# EAGLE design LEGO-Pi (EAGLE 6.5.0)
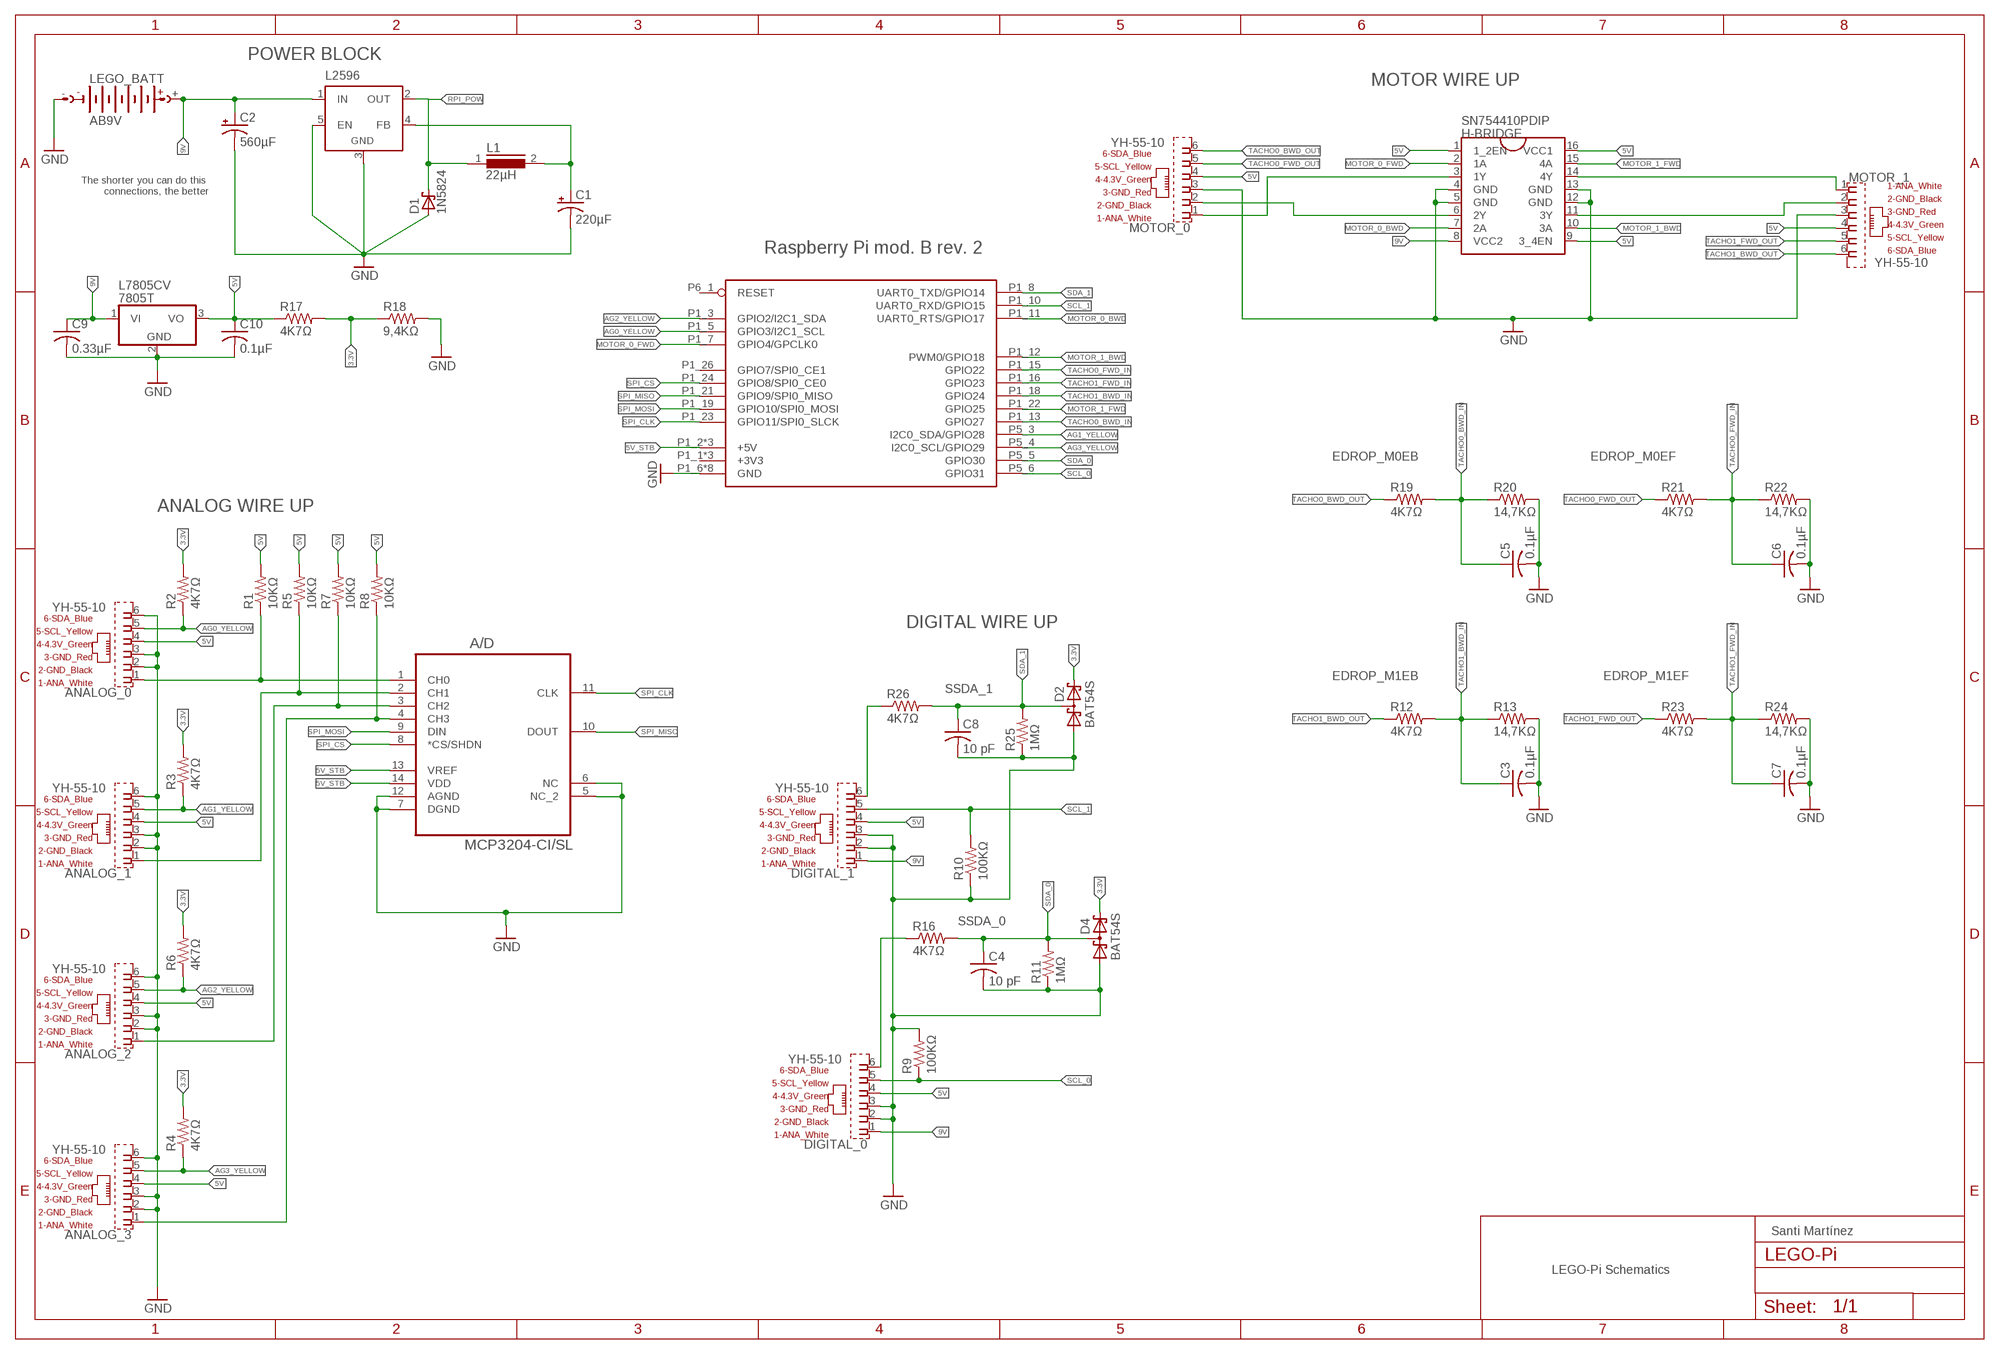
[diagram p0: schematic, sheet 1]

## Parts
A/D  MCP3204-CI/SL  [SOIC127P600X175-14N]
ANALOG_0  YH-55-10  [YH-55-10]
ANALOG_1  YH-55-10  [YH-55-10]
ANALOG_2  YH-55-10  [YH-55-10]
ANALOG_3  YH-55-10  [YH-55-10]
C1  220µF  CPOL-US085CS-1AR  [085CS_1AR]
C2  560µF  CPOL-US085CS-1AR  [085CS_1AR]
C3  0.1µF  C-US025-024X044  [C025-024X044]
C4  10 pF  C-US025-024X044  [C025-024X044]
C5  0.1µF  C-US025-024X044  [C025-024X044]
C6  0.1µF  C-US025-024X044  [C025-024X044]
C7  0.1µF  C-US025-024X044  [C025-024X044]
C8  10 pF  C-US025-024X044  [C025-024X044]
C9  0.33µF  C-US025-024X044  [C025-024X044]
C10  0.1µF  C-US025-024X044  [C025-024X044]
D1  1N5824  1N5908  [C4111-15]
D2  BAT54S  [SOT23]
D4  BAT54S  [SOT23]
DIGITAL_0  YH-55-10  [YH-55-10]
DIGITAL_1  YH-55-10  [YH-55-10]
H-BRIDGE  SN754410PDIP  [DIL16]
L1  22µH  SFT1040  [SFT1040]
L2596  LM2596TH  [TO220-52]
L7805CV  7805T  [TO220H]
LEGO_BATT  AB9V  [AB9V]
MOTOR_0  YH-55-10  [YH-55-10]
MOTOR_1  YH-55-10  [YH-55-10]
R1  10KΩ  R-US_0204/2V  [0204V]
R2  4K7Ω  R-US_0204/2V  [0204V]
R3  4K7Ω  R-US_0204/2V  [0204V]
R4  4K7Ω  R-US_0204/2V  [0204V]
R5  10KΩ  R-US_0204/2V  [0204V]
R6  4K7Ω  R-US_0204/2V  [0204V]
R7  10KΩ  R-US_0204/2V  [0204V]
R8  10KΩ  R-US_0204/2V  [0204V]
R9  100KΩ  R-US_0204/2V  [0204V]
R10  100KΩ  R-US_0204/2V  [0204V]
R11  1MΩ  R-US_0207/5V  [0207/5V]
R12  4K7Ω  R-US_0207/5V  [0207/5V]
R13  14,7KΩ  R-US_0207/5V  [0207/5V]
R16  4K7Ω  R-US_0207/5V  [0207/5V]
R17  4K7Ω  R-US_0207/5V  [0207/5V]
R18  9,4KΩ  R-US_0207/5V  [0207/5V]
R19  4K7Ω  R-US_0207/5V  [0207/5V]
R20  14,7KΩ  R-US_0207/5V  [0207/5V]
R21  4K7Ω  R-US_0207/5V  [0207/5V]
R22  14,7KΩ  R-US_0207/5V  [0207/5V]
R23  4K7Ω  R-US_0207/5V  [0207/5V]
R24  14,7KΩ  R-US_0207/5V  [0207/5V]
R25  1MΩ  R-US_0207/5V  [0207/5V]
R26  4K7Ω  R-US_0207/5V  [0207/5V]
U$1  RPI-B-V2  [RPI-A-SHIELD]

## Nets
3.3V [Logic_Power]: D2.2(C2) D4.2(C2) R2.2 R3.2 R4.2 R6.2 R17.2 R18.1
5V [Logic_Power]: ANALOG_0.4(4_4.3V_GREEN) ANALOG_1.4(4_4.3V_GREEN) ANALOG_2.4(4_4.3V_GREEN) ANALOG_3.4(4_4.3V_GREEN) C10.1 DIGITAL_0.4(4_4.3V_GREEN) DIGITAL_1.4(4_4.3V_GREEN) H-BRIDGE.1(1_2EN) H-BRIDGE.9(3_4EN) H-BRIDGE.16(VCC1) L7805CV.3(VO) MOTOR_0.4(4_4.3V_GREEN) MOTOR_1.4(4_4.3V_GREEN) R1.2 R5.2 R7.2 R8.2 R17.1
5V_STB [Logic_Power]: A/D.13(VREF) A/D.14(VDD) U$1.P1_2(+5V) U$1.P1_4(+5V) U$1.P5_1(+5V)
9V [Power]: C2.+ C9.1 DIGITAL_0.1(1_ANA_WHITE) DIGITAL_1.1(1_ANA_WHITE) H-BRIDGE.8(VCC2) L2596.1(IN) L7805CV.1(VI) LEGO_BATT.+
AG0_YELLOW: ANALOG_0.5(5_SCL_YELLOW) R2.1 U$1.P1_5(GPIO3/I2C1_SCL)
AG1_YELLOW: ANALOG_1.5(5_SCL_YELLOW) R3.1 U$1.P5_3(I2C0_SDA/GPIO28)
AG2_YELLOW: ANALOG_2.5(5_SCL_YELLOW) R6.1 U$1.P1_3(GPIO2/I2C1_SDA)
AG3_YELLOW: ANALOG_3.5(5_SCL_YELLOW) R4.1 U$1.P5_4(I2C0_SCL/GPIO29)
GND [Power]: A/D.5(NC_2) A/D.6(NC) A/D.7(DGND) A/D.12(AGND) ANALOG_0.2(2_GND_BLACK) ANALOG_0.3(3_GND_RED) ANALOG_0.6(6_SDA_BLUE) ANALOG_1.2(2_GND_BLACK) ANALOG_1.3(3_GND_RED) ANALOG_1.6(6_SDA_BLUE) ANALOG_2.2(2_GND_BLACK) ANALOG_2.3(3_GND_RED) ANALOG_2.6(6_SDA_BLUE) ANALOG_3.2(2_GND_BLACK) ANALOG_3.3(3_GND_RED) ANALOG_3.6(6_SDA_BLUE) C1.- C2.- C3.2 C4.2 C5.2 C6.2 C7.2 C8.2 C9.2 C10.2 D1.A D2.1(A1) D4.1(A1) DIGITAL_0.2(2_GND_BLACK) DIGITAL_0.3(3_GND_RED) DIGITAL_1.2(2_GND_BLACK) DIGITAL_1.3(3_GND_RED) H-BRIDGE.4(GND) H-BRIDGE.5(GND) H-BRIDGE.12(GND) H-BRIDGE.13(GND) L2596.3(GND) L2596.5(EN) L7805CV.2(GND) LEGO_BATT.- MOTOR_0.3(3_GND_RED) MOTOR_1.3(3_GND_RED) R9.2 R10.1 R11.1 R13.2 R18.2 R20.2 R22.2 R24.2 R25.1 U$1.P1_6(GND) U$1.P1_9(GND) U$1.P1_14(GND) U$1.P1_20(GND) U$1.P1_25(GND) U$1.P5_7(GND) U$1.P5_8(GND) U$1.P6_2(GND)
MOTOR_0_BWD: H-BRIDGE.7(2A) U$1.P1_11(UART0_RTS/GPIO17)
MOTOR_0_FWD: H-BRIDGE.2(1A) U$1.P1_7(GPIO4/GPCLK0)
MOTOR_1_BWD: H-BRIDGE.10(3A) U$1.P1_12(PWM0/GPIO18)
MOTOR_1_FWD: H-BRIDGE.15(4A) U$1.P1_22(GPIO25)
N$1: H-BRIDGE.14(4Y) MOTOR_1.1(1_ANA_WHITE)
N$2: H-BRIDGE.11(3Y) MOTOR_1.2(2_GND_BLACK)
N$3: A/D.2(CH1) ANALOG_1.1(1_ANA_WHITE) R5.1
N$4: A/D.1(CH0) ANALOG_0.1(1_ANA_WHITE) R1.1
N$5: C1.+ L1.2 L2596.4(FB)
N$6: A/D.3(CH2) ANALOG_2.1(1_ANA_WHITE) R7.1
N$7: A/D.4(CH3) ANALOG_3.1(1_ANA_WHITE) R8.1
N$9: H-BRIDGE.6(2Y) MOTOR_0.2(2_GND_BLACK)
N$10: H-BRIDGE.3(1Y) MOTOR_0.1(1_ANA_WHITE)
N$11: DIGITAL_0.6(6_SDA_BLUE) R16.1
N$13: DIGITAL_1.6(6_SDA_BLUE) R26.1
RPI_POW [Power]: D1.C L1.1 L2596.2(OUT)
SCL_0: DIGITAL_0.5(5_SCL_YELLOW) R9.1 U$1.P5_6(GPIO31)
SCL_1: DIGITAL_1.5(5_SCL_YELLOW) R10.2 U$1.P1_10(UART0_RXD/GPIO15)
SDA_0: C4.1 D4.3(C1A2) R11.2 R16.2 U$1.P5_5(GPIO30)
SDA_1: C8.1 D2.3(C1A2) R25.2 R26.2 U$1.P1_8(UART0_TXD/GPIO14)
SPI_CLK: A/D.11(CLK) U$1.P1_23(GPIO11/SPI0_SLCK)
SPI_CS: A/D.8(*CS/SHDN) U$1.P1_24(GPIO8/SPI0_CE0)
SPI_MISO: A/D.10(DOUT) U$1.P1_21(GPIO9/SPI0_MISO)
SPI_MOSI: A/D.9(DIN) U$1.P1_19(GPIO10/SPI0_MOSI)
TACHO0_BWD_IN: C5.1 R19.2 R20.1 U$1.P1_13(GPIO27)
TACHO0_BWD_OUT: MOTOR_0.6(6_SDA_BLUE)
TACHO0_FWD_IN: C6.1 R21.2 R22.1 U$1.P1_15(GPIO22)
TACHO0_FWD_OUT: MOTOR_0.5(5_SCL_YELLOW)
TACHO1_BWD_IN: C3.1 R12.2 R13.1 U$1.P1_18(GPIO24)
TACHO1_BWD_OUT: MOTOR_1.6(6_SDA_BLUE) R12.1
TACHO1_FWD_IN: C7.1 R23.2 R24.1 U$1.P1_16(GPIO23)
TACHO1_FWD_OUT: MOTOR_1.5(5_SCL_YELLOW) R23.1
Unconnected: R19.1 R21.1 U$1.P1_26(GPIO7/SPI0_CE1)

## Notes on the sheet
- POWER BLOCK
- MOTOR WIRE UP
- The shorter you can do this 
  connections, the better
- Raspberry Pi mod. B rev. 2
- EDROP_M0EB | EDROP_M0EF
- ANALOG WIRE UP
- DIGITAL WIRE UP
- EDROP_M1EB | EDROP_M1EF
- SSDA_1
- SSDA_0
- Santi Martínez
- LEGO-Pi Schematics

## Power pins joined to a net without a drawn wire
+3V3: U$1.P1_1(+3V3) U$1.P1_17(+3V3) U$1.P5_2(+3V3)
RESET: U$1.P6_1(RESET)

## Library data of the parts
A/D = Microchip_By_element14_Batch_1:MCP3204-CI/SL: IC ADC 12BIT 2.7V 4CH SPI; MPN: MCP3204-CI/SL; OC_FARNELL: 1196795; OC_NEWARK: 26M1276; PACKAGE: 14 - SOIC; SUPPLIER: Microchip
ANALOG_0 ANALOG_1-ANALOG_3 DIGITAL_0 DIGITAL_1 MOTOR_0 MOTOR_1 = DEXTER INDUSTRIES NXT Female Adapter (2!!):YH-55-10: RJ11 6 connects Source:Dexter Industries LEGO MINDSTORMS NXT Female Adapter; OC_FARNELL: unknown; OC_NEWARK: unknown
C1 C2 = resistor:CPOL-US: POLARIZED CAPACITOR, American symbol
C3-C10 = resistor:C-US: CAPACITOR, American symbol
D1 = diode:1N5908: DIODE schottky
D2 D4 = diode:BAT54S: Schottky Diodes Pin connection corrected 2011-05-04 Source: Fairchild .. BAT54.pdf
H-BRIDGE = AlexW-Eagle-Libraries:SN754410
L1 = inductors:SFT1040: INDUCTOR
L2596 = linear:LM2596T: STEP-DOWN VOLTAGE REGULATOR
L7805CV = linear:78*: Positive VOLTAGE REGULATOR Source: http://cache.national.com/ds/LM/LM78L05.pdf http://www.fairchildsemi.com/ds/LM/LM7805.pdf
LEGO_BATT = battery:AB9V: 9-V BATTERY CLIP
R1-R13 R16-R26 = resistor:R-US_: RESISTOR, American symbol
U$1 = raspberry:RPI-B-V2: Second revision of the Model 2 board including the P5 and P6 headers. Mounting holes have been added. Choose the "SHIELD" variant for a predefined Dimension layer and drilling holes. Theres also a "SHIELD" variant for the Model A without a RJ45 connector.

## Net classes
0 DATA: width 0.254 mm, drill 0.5 mm, clearance 0.254 mm
1 Power: width 0.508 mm, drill 0.6 mm, clearance 0.254 mm
2 Logic_Power: width 0.381 mm, drill 0.6 mm, clearance 0.254 mm

## Board
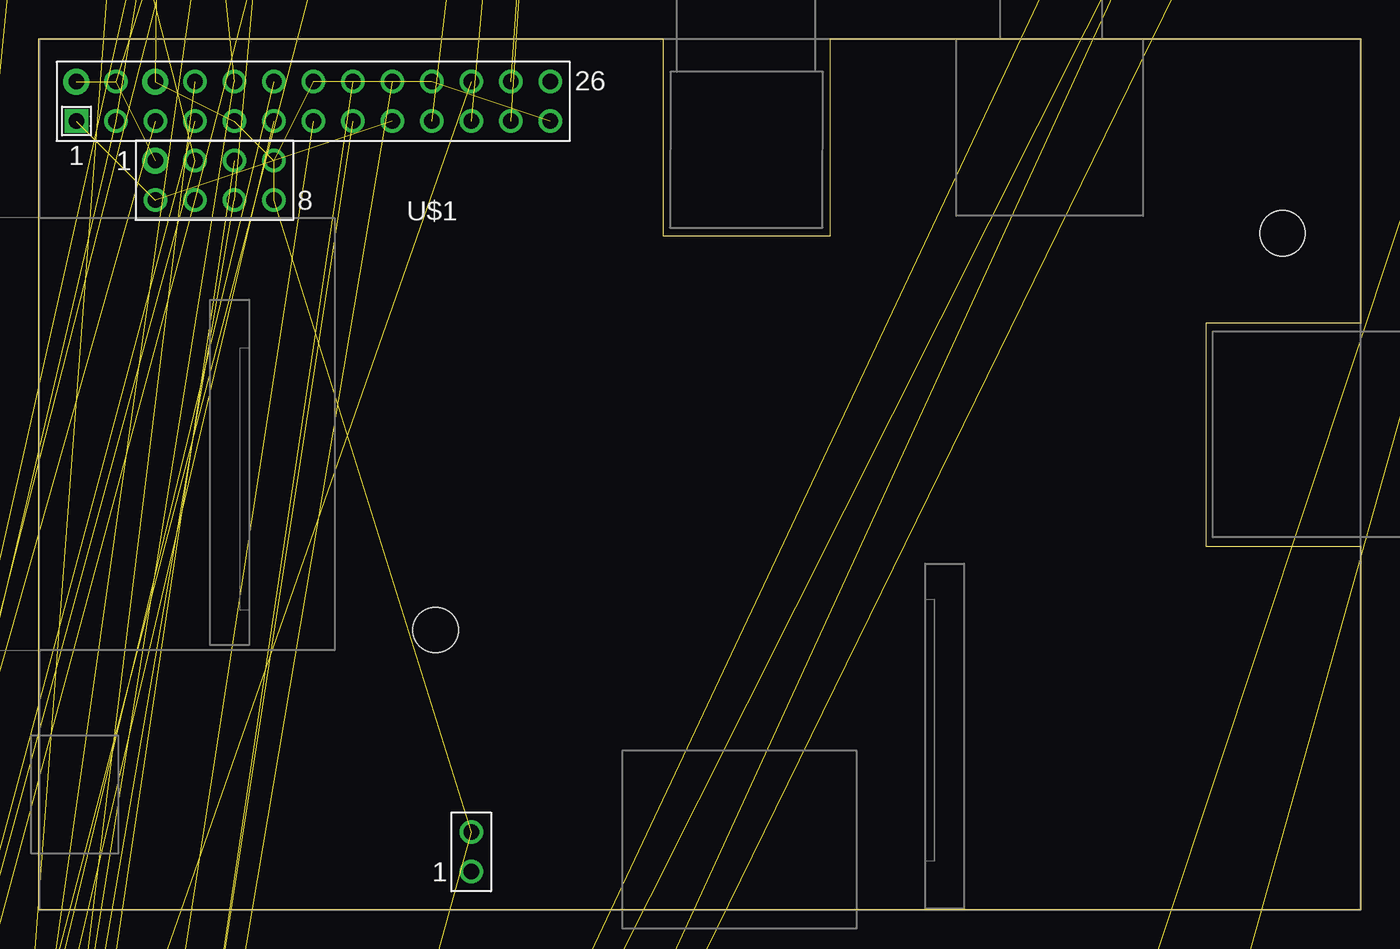
[diagram p1: board, top side]
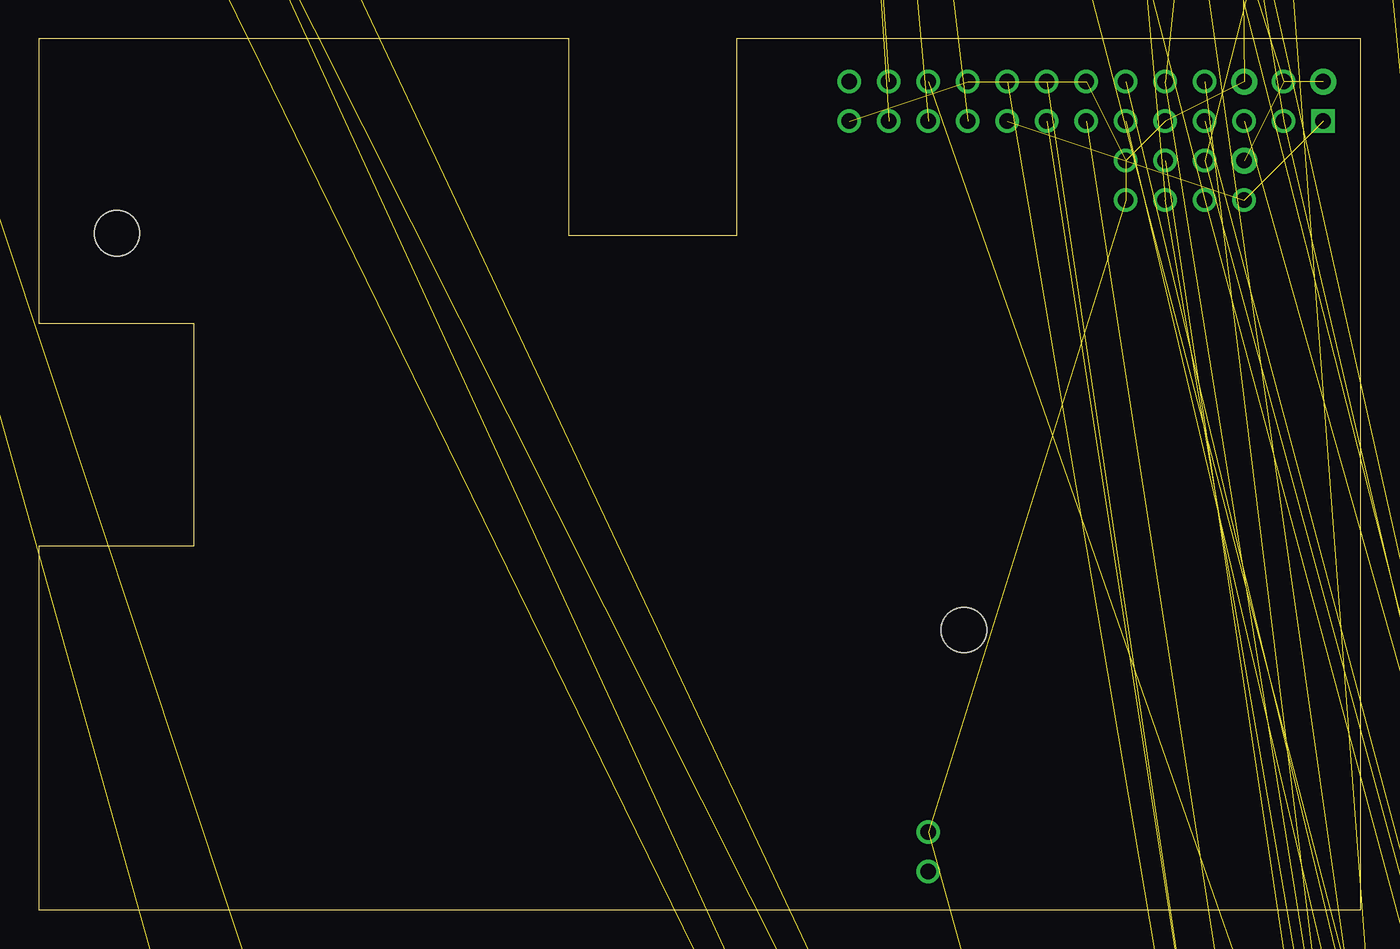
[diagram p2: board, bottom side, seen from below]

Size 85.01 x 56.01 mm. Coordinates in mm from the lower left corner, seen from the top.
Copper layers (1*16): Top 0.035mm / dielectric 1.5mm / Bottom 0.035mm
Design rules "default": minimum track width 10mil, minimum drill 24mil, track to track 8mil, track to pad 8mil, pad to pad 8mil, via to via 8mil, smd to smd 8mil, copper to edge 40mil, drill to drill 8mil, minimum pad ring 10mil, minimum via ring 8mil, stop-mask expansion 4mil, vias tented up to drill 0mil, thermal gap 10mil

### Footprints (pad centres in the part's own frame; a part is rotated, then mirrored left to right if it is on the bottom)
SOIC127P600X175-14N = smd 1.981 x 0.559: 1 -2.362,3.81; 2 -2.362,2.54; 3 -2.362,1.27; 4 -2.362,0; 5 -2.362,-1.27; 6 -2.362,-2.54; 7 -2.362,-3.81; 8 2.362,-3.81; 9 2.362,-2.54; 10 2.362,-1.27; 11 2.362,0; 12 2.362,1.27; 13 2.362,2.54; 14 2.362,3.81
YH-55-10 = drill 0.8 pad 1.3: 1 2.54,4.84; 2 1.54,2.3; 3 0.5,4.84; 4 -0.5,2.3; 5 -1.54,4.84; 6 -2.54,2.3 | hole 2.36: -6,0; 6,0
085CS_1AR = smd 2.9 x 2.5: + 3.25,0; - -3.25,0
C025-024X044 = drill 0.813 octagon: 1 -1.27,0; 2 1.27,0
C4111-15 = drill 1.499 long: A 7.62,0; C -7.62,0
SOT23 = smd 1 x 1.4: 1 -0.95,-1.1; 2 0.95,-1.1; 3 0,1.1
DIL16 = drill 0.813 long: 1 -8.89,-3.81; 2 -6.35,-3.81; 3 -3.81,-3.81; 4 -1.27,-3.81; 5 1.27,-3.81; 6 3.81,-3.81; 7 6.35,-3.81; 8 8.89,-3.81; 9 8.89,3.81; 10 6.35,3.81; 11 3.81,3.81; 12 1.27,3.81; 13 -1.27,3.81; 14 -3.81,3.81; 15 -6.35,3.81; 16 -8.89,3.81
SFT1040 = drill 1.118 long: 1 -7.62,0; 2 7.62,0
TO220-52 = drill 0.9 long: 1 -3.4,-21.1; 2 -1.7,-18.47; 3 0,-21.1; 4 1.7,-18.47; 5 3.4,-21.1 | hole 3.8: 0,-2.8
TO220H = drill 1.118 long: 1 -2.54,-10.16; 2 0,-10.16; 3 2.54,-10.16 | hole 3.302: 0,4.826
AB9V = drill 1.118 pad 3.15 octagon: + 0,2.54; - 0,-2.54
0204V = drill 0.813 octagon: 1 -1.27,0; 2 1.27,0
0207/5V = drill 0.813 octagon: 1 -2.54,0; 2 2.54,0
RPI-A-SHIELD = drill 1 square: P1_1 0,0 | drill 1 pad 1.676: P1_2 0,2.54; P1_6 5.08,2.54; P5_1 5.08,-2.54 | drill 1: P1_3 2.54,0; P1_4 2.54,2.54; P1_5 5.08,0; P1_7 7.62,0; P1_8 7.62,2.54; P1_9 10.16,0; P1_10 10.16,2.54; P1_11 12.7,0; P1_12 12.7,2.54; P1_13 15.24,0; P1_14 15.24,2.54; P1_15 17.78,0; P1_16 17.78,2.54; P1_17 20.32,0; P1_18 20.32,2.54; P1_19 22.86,0; P1_20 22.86,2.54; P1_21 25.4,0; P1_22 25.4,2.54; P1_23 27.94,0; P1_24 27.94,2.54; P1_25 30.48,0; P1_26 30.48,2.54; P5_2 5.08,-5.08; P5_3 7.62,-2.54; P5_4 7.62,-5.08; P5_5 10.16,-2.54; P5_6 10.16,-5.08; P5_7 12.7,-2.54; P5_8 12.7,-5.08; P6_1 25.4,-48.26; P6_2 25.4,-45.72 | hole 2.9: 23.1,-32.72; 77.57,-7.21

### Placement (x,y rotation side)
A/D  34.61,151.32 0 top  (outside the outline)
ANALOG_0  -52.29,-170.58 0 top  (outside the outline)
ANALOG_1  -7.79,118.92 0 top  (outside the outline)
ANALOG_2  21.21,134.32 0 top  (outside the outline)
ANALOG_3  35.81,134.32 0 top  (outside the outline)
C1  -39.39,-143.88 0 top  (outside the outline)
C2  -39.39,-150.48 0 top  (outside the outline)
C3  -57.19,-410.68 0 top  (outside the outline)
C4  -57.19,-415.08 0 top  (outside the outline)
C5  -57.19,-441.38 0 top  (outside the outline)
C6  -57.19,-458.28 0 top  (outside the outline)
C7  -57.19,-475.18 0 top  (outside the outline)
C8  -57.19,-499.38 0 top  (outside the outline)
C9  -72.99,-516.28 0 top  (outside the outline)
C10  -72.99,-522.58 0 top  (outside the outline)
D1  -34.89,-136.88 0 top  (outside the outline)
D2  -57.09,-492.58 0 top  (outside the outline)
D4  -57.09,-423.98 0 top  (outside the outline)
DIGITAL_0  21.21,118.92 0 top  (outside the outline)
DIGITAL_1  6.71,118.92 0 top  (outside the outline)
H-BRIDGE  -47.19,-182.58 0 top  (outside the outline)
L1  -36.39,-121.08 0 top  (outside the outline)
L2596  -21.39,-108.98 0 top  (outside the outline)
L7805CV  -67.49,-500.88 0 top  (outside the outline)
LEGO_BATT  -9.49,-127.08 0 top  (outside the outline)
MOTOR_0  131.39,188.2 90 top  (outside the outline)
MOTOR_1  131.33,171.81 90 top  (outside the outline)
R1  -56.79,-191.38 0 top  (outside the outline)
R2  -56.79,-195.28 0 top  (outside the outline)
R3  -56.79,-200.98 0 top  (outside the outline)
R4  -56.79,-206.68 0 top  (outside the outline)
R5  -56.79,-212.38 0 top  (outside the outline)
R6  -56.79,-218.08 0 top  (outside the outline)
R7  -56.79,-223.78 0 top  (outside the outline)
R8  -56.79,-229.48 0 top  (outside the outline)
R9  -56.79,-365.38 0 top  (outside the outline)
R10  -56.79,-371.08 0 top  (outside the outline)
R11  -55.59,-390.18 0 top  (outside the outline)
R12  -55.59,-394.18 0 top  (outside the outline)
R13  -55.59,-398.18 0 top  (outside the outline)
R16  -55.59,-418.98 0 top  (outside the outline)
R17  -55.59,-435.58 0 top  (outside the outline)
R18  -55.59,-430.28 0 top  (outside the outline)
R19  -55.59,-452.48 0 top  (outside the outline)
R20  -55.59,-447.18 0 top  (outside the outline)
R21  -55.59,-469.38 0 top  (outside the outline)
R22  -55.59,-464.08 0 top  (outside the outline)
R23  -55.59,-486.28 0 top  (outside the outline)
R24  -55.59,-480.98 0 top  (outside the outline)
R25  -55.59,-510.48 0 top  (outside the outline)
R26  -55.59,-505.18 0 top  (outside the outline)
U$1  2.41,50.72 0 top

### Tracks (layer width: path | path; a pad name or v marks a point on that pad's centre or on a via)
3.3V  (7 unrouted)
5V  (17 unrouted)
5V_STB  (4 unrouted)
9V  (7 unrouted)
+3V3  (2 unrouted)
AG0_YELLOW  (2 unrouted)
AG1_YELLOW  (2 unrouted)
AG2_YELLOW  (2 unrouted)
AG3_YELLOW  (2 unrouted)
GND  (59 unrouted)
  pour Bottom: 50.15,199.54 132.7,199.54 132.7,144.93 50.15,144.93
MOTOR_0_BWD  (1 unrouted)
MOTOR_0_FWD  (1 unrouted)
MOTOR_1_BWD  (1 unrouted)
MOTOR_1_FWD  (1 unrouted)
N$1  (1 unrouted)
N$2  (1 unrouted)
N$3  (2 unrouted)
N$4  (2 unrouted)
N$5  (2 unrouted)
N$6  (2 unrouted)
N$7  (2 unrouted)
N$9  (1 unrouted)
N$10  (1 unrouted)
N$11  (1 unrouted)
N$13  (1 unrouted)
RPI_POW  (2 unrouted)
SCL_0  (2 unrouted)
SCL_1  (2 unrouted)
SDA_0  (4 unrouted)
SDA_1  (4 unrouted)
SPI_CLK  (1 unrouted)
SPI_CS  (1 unrouted)
SPI_MISO  (1 unrouted)
SPI_MOSI  (1 unrouted)
TACHO0_BWD_IN  (3 unrouted)
TACHO0_FWD_IN  (3 unrouted)
TACHO1_BWD_IN  (3 unrouted)
TACHO1_BWD_OUT  (1 unrouted)
TACHO1_FWD_IN  (3 unrouted)
TACHO1_FWD_OUT  (1 unrouted)